# EasyEDA Pro project Bike-Computer-v2.eprj

# Schematic Schematic3
Create Date: 2023-03-25; Page Name: 母板原理图; Project Name: 结题工程v2; Schematic Name: Schematic3; Update Date: 2023-12-21; Add into BOM: yes; Company: 立项小组; Convert to PCB: yes; Drawed: chaos0514; Version: V2.0
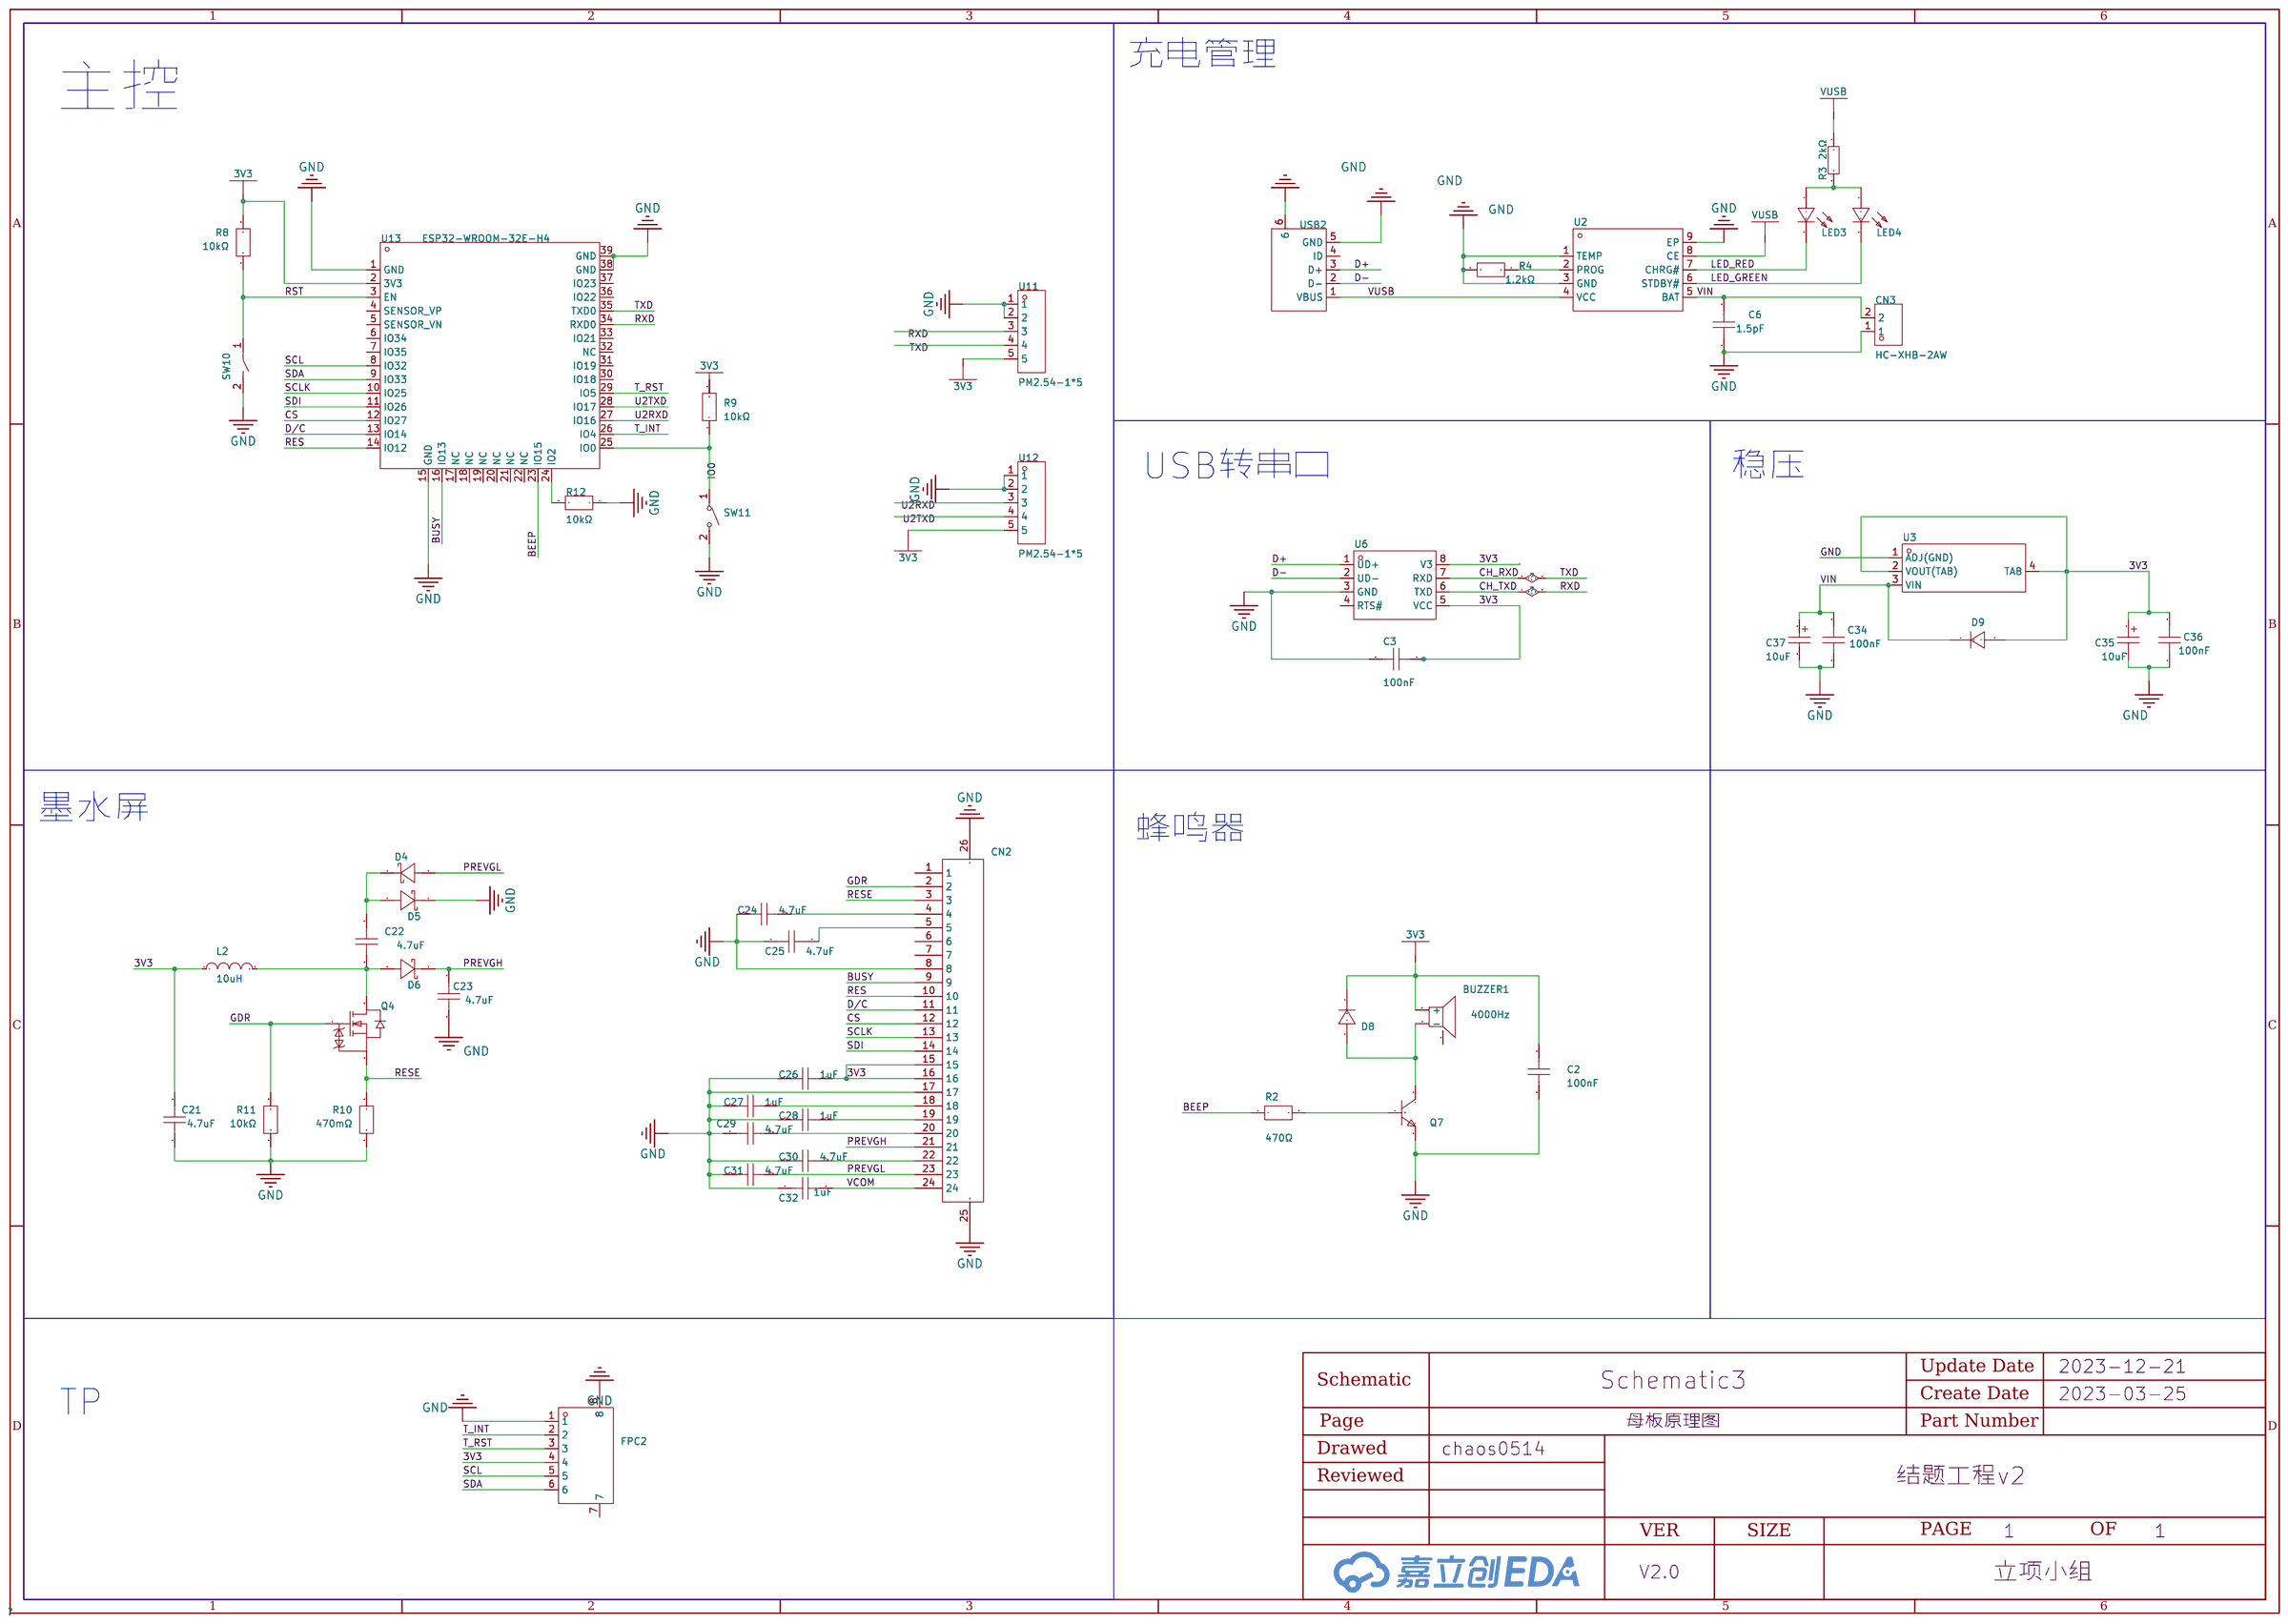
[diagram p0: schematic sheet]

## Parts
BUZZER1  4000Hz  [BUZ-SMD_L5.0-W5.5-P4.60]
C2  100nF  [C0603]
C3  100nF  [C0603]
C6  1.5pF  [C0603]
C21  4.7uF  [C0603]
C22  4.7uF  [C0603]
C23  4.7uF  [C0603]
C24  4.7uF  [C0603]
C25  4.7uF  [C0603]
C26  1uF  [C0603]
C27  1uF  [C0603]
C28  1uF  [C0603]
C29  4.7uF  [C0603]
C30  4.7uF  [C0603]
C31  4.7uF  [C0603]
C32  1uF  [C0603]
C34  100nF  [C0603]
C35  10uF  [CAP-SMD_L3.2-W1.6-RD]
C36  100nF  [C0603]
C37  10uF  [CAP-SMD_L3.2-W1.6-RD]
CN2  0.5-24P翻盖  [FPC-SMD_24P-P0.50-L6.1-W16.4]
CN3  HC-XHB-2AW  [CONN-TH_2P-P2.50_HCTL_HC-XHB-2AW]
D4  MBR0530  [SOD-123_L2.7-W1.6-LS3.7-RD-1]
D5  MBR0530  [SOD-123_L2.7-W1.6-LS3.7-RD-1]
D6  MBR0530  [SOD-123_L2.7-W1.6-LS3.7-RD-1]
D8  IN4148WS  [SOD-323_L1.8-W1.3-LS2.5-RD]
D9  IN4148WS  [SOD-323_L1.8-W1.3-LS2.5-RD]
FPC2  0.5K-DX-6PWB  [FPC-SMD_6P-P0.50_DEALON_0.5K-DX-6PWB]
L2  10uH  [IND-SMD_L2.0-W1.6]
LED3  NCD0603R1  [LED0603-RD_RED]
LED4  NCD0603R1  [LED0603-RD_RED]
Q4  SI1308EDL-T1-GE3  [SOT-323_L2.0-W1.3-P1.30-LS2.1-BR]
Q7  KST8050S  [SOT-23_L2.9-W1.3-P1.90-LS2.4-BR]
R2  470Ω  [R0603]
R3  2kΩ  [R0603]
R4  1.2kΩ  [R0603]
R8  10kΩ  [R0603]
R9  10kΩ  [R0603]
R10  470mΩ  [R0603]
R11  10kΩ  [R0603]
R12  10kΩ  [R0603]
SW10  YTSB013A0502501B  [SW-SMD_L6.0-W3.5-LS8.0]
SW11  TS-1096S-A2B3-C1D2  [SW-SMD_L6.0-W3.3-LS8.0]
U2  -  [ESOP-8_L4.9-W3.9-P1.27-LS6.0-BL-EP]
U3  AMS1117-3.3  [SOT-223-4_L6.5-W3.5-P2.30-LS7.0-BR]
U6  -  [SOP-8_L4.9-W3.9-P1.27-LS6.0-BL]
U11  PM2.54-1*5  [HDR-TH_5P-P2.54-V-F]
U12  PM2.54-1*5  [HDR-TH_5P-P2.54-V-F]
U13  ESP32-WROOM-32E-H4  [WIFI-SMD_ESP32-WROOM-32E]
USB2  U254-051N-4BH24-S2S  [MICRO-USB-SMD_U254-051N-4BH24-S2]

## Library data of the parts
BUZZER1 = MLT-5020: 驱动方式:无源(外部驱动);构造类型:电磁式;频率:4000Hz;长度:5.2mm;宽度:5.2mm;高度:2.5mm;; Supplier Part: C94598; Manufacturer: 华能; Supplier Footprint: SMD,5x5mm; JLCPCB Part Class: Extended Part; Datasheet: https://atta.szlcsc.com/upload/public/pdf/source/20210811/111454390007D221D7259018FB170E62.pdf; Supplier: LCSC; Oscillator Circuit: 无源(外部驱动); Technology Type: 电磁式; Length: 5.2mm; Width: 5.2mm; Height: 2.5mm
C2 C3 C34 C36 = CC0603KRX7R9BB104: 容值:100nF;精度:±10%;额定电压:50V;材质(温度系数):X7R;; LCSC Part Name: 100nF ±10% 50V; Supplier Part: C14663; Manufacturer: YAGEO(国巨); Supplier Footprint: 0603; JLCPCB Part Class: Basic Part; Datasheet: https://atta.szlcsc.com/upload/public/pdf/source/20180910/C282072_33301C7F631E79921B82A8DAC6BCC5B3.pdf; Supplier: LCSC; Tolerance: ±10%; Voltage Rated: 50V; Temperature Coefficient: X7R
C6 = MT18N1R5C500CT: 容值:1.5pF;额定电压:50V;材质(温度系数):NP0;; LCSC Part Name: 1.5pF 50V ±0.25pF; Supplier Part: C908503; Manufacturer: Walsin(华新科); Supplier Footprint: 0603; JLCPCB Part Class: Extended Part; Datasheet: https://atta.szlcsc.com/upload/public/pdf/source/20191217/C470045_C8EA1FED8E7D9FF06975A0CE3DEB0325.pdf; Supplier: LCSC; Voltage Rated: 50V; Temperature Coefficient: NP0; Tolerance: ±0.25pF
C21-C25 C29-C31 = C1608X5R1V475KT000E: 容值:4.7uF;精度:±10%;额定电压:35V;材质(温度系数):X5R;; LCSC Part Name: 4.7uF ±10% 35V; Supplier Part: C329940; Manufacturer: TDK; Supplier Footprint: 0603; JLCPCB Part Class: Extended Part; Datasheet: https://atta.szlcsc.com/upload/public/pdf/source/20190926/C329940_3676AC3B1F2ADAB27683D7ACF547C42E.pdf; Supplier: LCSC; Tolerance: ±10%; Voltage Rated: 35V; Temperature Coefficient: X5R
C26-C28 C32 = CL10A105KB8NNNC: 容值:1uF;精度:±10%;额定电压:50V;材质(温度系数):X5R;; LCSC Part Name: 1uF ±10% 50V; Supplier Part: C15849; Manufacturer: SAMSUNG(三星); Supplier Footprint: 0603; JLCPCB Part Class: Basic Part; Datasheet: https://atta.szlcsc.com/upload/public/pdf/source/20160218/1457707763339.pdf; Supplier: LCSC; Tolerance: ±10%; Voltage Rated: 50V; Temperature Coefficient: X5R
C35 C37 = CA45-A-16V-10uF-K: 容值:10uF;精度:±10%;额定电压:16V;等效串联电阻:10Ω@100kHz;; LCSC Part Name: 10uF ±10% 16V; Supplier Part: C128254; Manufacturer: CEC(振华新云); Supplier Footprint: CASE-A-3216; JLCPCB Part Class: Extended Part; Datasheet: https://atta.szlcsc.com/upload/public/pdf/source/20170914/C128254_1505359752472967905.pdf; Supplier: LCSC; Tolerance: ±10%; Rated Voltage: 16V; Equivalent Series Resistance(ESR): 10Ω@100kHz; Operating Temperature: -55℃~+125℃
CN2 = 0.5-24P翻盖: 间距:0.5mm;触点数量:24P;锁定特性:翻盖式;触点类型:下接;安装类型:卧贴;工作温度范围:-;; LCSC Part Name: 间距:0.5mm P数:24P 翻盖式 下接; Supplier Part: C20688; Manufacturer: BOOMELE(博穆精密); Supplier Footprint: SMD,P=0.5mm,卧贴; JLCPCB Part Class: Extended Part; Datasheet: https://atta.szlcsc.com/upload/public/pdf/source/20210518/C2835077_01BB588238C9E5C5C5B2931B95D00EB1.pdf; Supplier: LCSC; Pitch: 0.5mm; Number of Contacts: 24P; Locking Feature: 翻盖式; FFC, FCB Thickness: 0.3mm; Contact Type: 下接; Mounting Type: 卧贴; Height Above Board: 2mm
CN3 = HC-XHB-2AW_C2845505: 插针结构:1x2P;间距:2.5mm;公母:公;安装方式:弯插;行距:-;排数:1;每排PIN数:2;参考系列:-;额定电流:3A;工作温度范围:-25℃~+85℃;; LCSC Part Name: 1x2P 间距:2.5mm 弯插; Supplier Part: C2845505; Manufacturer: HCTL(华灿天禄); Supplier Footprint: 弯插,P=2.5mm; JLCPCB Part Class: Extended Part; Datasheet: https://atta.szlcsc.com/upload/public/pdf/source/20230711/E76CB2F3936D97053488B02AAFAB274A.pdf; Supplier: LCSC; Pins Structure: 1x2P; Pitch: 2.5mm; Gender: 公; Mounting Style: 弯插; Number of Rows: 1; Number of PINs Per Row: 2; Current Rating (Max): 3A; Operating Temperature Range: -25℃~+85℃
D4-D6 = MBR0530_C699108: 直流反向耐压(Vr):30V;平均整流电流(Io):500mA;正向压降(Vf):550mV@500mA;; LCSC Part Name: 电压:30V 电流:500mA; Supplier Part: C699108; Manufacturer: YANGJIE(扬杰); Supplier Footprint: SOD-123; JLCPCB Part Class: Extended Part; Datasheet: https://atta.szlcsc.com/upload/public/pdf/source/20200709/C699108_94C8F1A54679DD603C9696C8694A3BC2.pdf; Supplier: LCSC; Reverse Voltage (Vr): 30V; Average Rectified Current (Io): 500mA; Forward Voltage (Vf@If): 550mV@500mA; Reverse Leakage Current (Ir): 100uA@30V
D8 D9 = IN4148WS: 二极管配置:独立式;功率:200mW;直流反向耐压(Vr):100V;平均整流电流(Io):200mA;正向压降(Vf):1V@10mA;反向电流(Ir):5A@75V;反向恢复时间(trr):4ns;工作温度:+150@(Tj);; LCSC Part Name: 100V 200mA 4ns; Supplier Part: C417545; Manufacturer: LRC(乐山无线电); Supplier Footprint: SOD-323; JLCPCB Part Class: 扩展库; Datasheet: https://atta.szlcsc.com/upload/public/pdf/source/20190911/C417545_CB999573A39316D3E44B0FF1B4B78E30.pdf; Supplier: LCSC; Diode Configuration: 独立式; Power Dissipation: 200mW; Reverse Voltage (Vr): 100V; Average Rectified Current (Io): 200mA; Forward Voltage (Vf@If): 1V@10mA; Reverse Leakage Current: 5A@75V; Reverse Recovery Time (trr): 4ns; Operating Temperature: +150@(Tj)
FPC2 = 0.5K-DX-6PWB: 间距:0.5mm;触点数量:6P;锁定特性:翻盖式;触点类型:下接;安装类型:卧贴;工作温度范围:-20℃~+85℃;; LCSC Part Name: 间距:0.5mm P数:6P 翻盖式 下接; Supplier Part: C2911832; Manufacturer: HDGC(华德共创); Supplier Footprint: SMD,P=0.5mm,卧贴; JLCPCB Part Class: Extended Part; Datasheet: https://atta.szlcsc.com/upload/public/pdf/source/20211029/5210AEC837E1AC9B697C39805C1E664F.pdf; Supplier: LCSC; Pitch: 0.5mm; Number of Contacts: 6P; Locking Feature: 翻盖式; FFC, FCB Thickness: 0.3mm; Contact Type: 下接; Mounting Type: 卧贴; Height Above Board: 2mm; Operating Temperature Range: -20℃~+85℃
L2 = WPN201610H100MT: 电感值:10uH;精度:±20%;额定电流:650mA;类型:-;饱和电流(Isat):800mA;; LCSC Part Name: 10uH ±20% 800mA; Supplier Part: C89132; Manufacturer: Sunlord(顺络); Supplier Footprint: 0806; JLCPCB Part Class: Extended Part; Datasheet: https://atta.szlcsc.com/upload/public/pdf/source/20231024/AA72387348CB63159A6CBE41DDE5ECDA.pdf; Supplier: LCSC; Tolerance: ±20%; Rated Current: 650mA; DC Resistance (DCR): 826mΩ; Saturation Current (Isat): 800mA
LED3 LED4 = NCD0603R1_C84263: 发光颜色:红色;功率:65mW;透镜颜色:无色透明;主波长:615nm~630nm;发光强度:80mcd~220mcd;发光角度:130°;工作温度:-30℃~+85℃;; LCSC Part Name: 红灯 0603红灯   正贴; Supplier Part: C84263; Manufacturer: 国星光电; Supplier Footprint: 0603; JLCPCB Part Class: Extended Part; Datasheet: https://atta.szlcsc.com/upload/public/pdf/source/20200820/C84263_DABC6A75E58F576973B407FDBA283D60.pdf; Supplier: LCSC; Emitted Color: 红色; Forward Voltage (VF): 1.6V~2.6V; Forward Current: 20mA; Power Dissipation: 65mW; Lens Color: 无色透明; Dominant Wavelength: 615nm~630nm; Luminous Intensity: 80mcd~220mcd; Viewing Angle: 130°; Operating Temperature: -30℃~+85℃
Q4 = SI1308EDL-T1-GE3: 类型:N沟道;漏源电压(Vdss):30V;连续漏极电流(Id):1.4A;功率(Pd):400mW；500mW;导通电阻(RDS(on)@Vgs,Id):132mΩ@10V,1.4A;; LCSC Part Name: N沟道 30V 1.4A; Supplier Part: C469327; Manufacturer: VISHAY(威世); Supplier Footprint: SOT-323; JLCPCB Part Class: Extended Part; Datasheet: https://atta.szlcsc.com/upload/public/pdf/source/20191217/C469327_3FE8BCBB7604A1B1F6779A1D9DD725BB.pdf; Supplier: LCSC; Type: N沟道; Drain Source Voltage (Vdss): 30V; Continuous Drain Current (Id): 1.4A; Power Dissipation (Pd): 400mW；500mW; Drain Source On Resistance (RDS(on)@Vgs,Id): 132mΩ@10V,1.4A; Gate Threshold Voltage (Vgs(th)@Id): 1.5V@250uA; Total Gate Charge (Qg@Vgs): 4.1nC@10V; Input Capacitance (Ciss@Vds): 105pF@15V; Operating Temperature: -55℃~+150℃@(Tj)
Q7 = KST8050S: 晶体管类型:NPN;集射极击穿电压(Vceo):25V;集电极电流(Ic):500mA;功率(Pd):300mW;; Supplier Part: C369924; Manufacturer: KEXIN(科信); Supplier Footprint: SOT-23; JLCPCB Part Class: 扩展库; Datasheet: https://atta.szlcsc.com/upload/public/pdf/source/20190320/C369924_F8D3618043520638745BFFFB8460FA42.pdf; Supplier: LCSC; Transistor Type: NPN; Collector-Emitter Breakdown Voltage (Vceo): 25V; Collector Current (Ic): 500mA; Power Dissipation (Pd): 300mW
R2 = 0603WAF4700T5E: 阻值:470Ω;精度:±1%;功率:100mW;温度系数:±100ppm/℃;电阻类型:厚膜电阻;; LCSC Part Name: 470Ω ±1% 100mW 厚膜电阻; Supplier Part: C23179; Manufacturer: UNI-ROYAL(厚声); Supplier Footprint: 0603; JLCPCB Part Class: Basic Part; Datasheet: https://atta.szlcsc.com/upload/public/pdf/source/20200306/C422600_1E6D84923E4A46A82E41ADD87F860B5C.pdf; Supplier: LCSC; Tolerance: ±1%; Power(Watts): 100mW; Overload Voltage (Max): 75V; Temperature Coefficient: ±100ppm/℃; Type: 厚膜电阻; Operating Temperature Range: -55℃~+155℃
R3 = 0603WAF2001T5E: 阻值:2kΩ;精度:±1%;功率:100mW;温度系数:±100ppm/℃;电阻类型:厚膜电阻;; LCSC Part Name: 2kΩ ±1% 100mW 厚膜电阻; Supplier Part: C22975; Manufacturer: UNI-ROYAL(厚声); Supplier Footprint: 0603; JLCPCB Part Class: Basic Part; Datasheet: https://atta.szlcsc.com/upload/public/pdf/source/20200306/C422600_1E6D84923E4A46A82E41ADD87F860B5C.pdf; Supplier: LCSC; Tolerance: ±1%; Power(Watts): 100mW; Overload Voltage (Max): 75V; Temperature Coefficient: ±100ppm/℃; Type: 厚膜电阻; Operating Temperature Range: -55℃~+155℃
R4 = 0603WAF1201T5E: 阻值:1.2kΩ;精度:±1%;功率:100mW;温度系数:±100ppm/℃;电阻类型:厚膜电阻;; LCSC Part Name: 1.2kΩ ±1% 100mW 厚膜电阻; Supplier Part: C22765; Manufacturer: UNI-ROYAL(厚声); Supplier Footprint: 0603; JLCPCB Part Class: Basic Part; Datasheet: https://atta.szlcsc.com/upload/public/pdf/source/20200306/C422600_1E6D84923E4A46A82E41ADD87F860B5C.pdf; Supplier: LCSC; Tolerance: ±1%; Power(Watts): 100mW; Overload Voltage (Max): 75V; Temperature Coefficient: ±100ppm/℃; Type: 厚膜电阻; Operating Temperature Range: -55℃~+155℃
R8 R9 R11 R12 = SG73P1JTTD1002F: 阻值:10kΩ;精度:±1%;功率:-;; LCSC Part Name: 10kΩ ±1%; Supplier Part: C880254; Manufacturer: KOA; Supplier Footprint: 0603; JLCPCB Part Class: Extended Part; Datasheet: https://atta.szlcsc.com/upload/public/pdf/source/20190109/C346159_A2BB9C83E7E727C8F8277542505B206B.pdf; Supplier: LCSC; Tolerance: ±1%
R10 = 0603WAF470LT5E: 阻值:470mΩ;精度:±1%;功率:100mW;温度系数:±800ppm/℃;电阻类型:厚膜电阻;; LCSC Part Name: 470mΩ ±1% 100mW 厚膜电阻; Supplier Part: C23411; Manufacturer: UNI-ROYAL(厚声); Supplier Footprint: 0603; JLCPCB Part Class: Extended Part; Datasheet: https://atta.szlcsc.com/upload/public/pdf/source/20200306/C422600_1E6D84923E4A46A82E41ADD87F860B5C.pdf; Supplier: LCSC; Tolerance: ±1%; Power(Watts): 100mW; Overload Voltage (Max): 75V; Temperature Coefficient: ±800ppm/℃; Type: 厚膜电阻; Operating Temperature Range: -55℃~+155℃
SW10 = YTSB013A0502501B: 电路结构:单刀单掷;带支架:否;触点电流:50mA;额定电压(DC):12V;安装方式:立贴;绝缘电阻:100MΩ;作用力:250gf;机械寿命:2万次;; LCSC Part Name: 6*3.5*5mm 立贴 轻触开关 编带; Supplier Part: C967845; Manufacturer: DGBZ(东莞博众); Supplier Footprint: SMD; JLCPCB Part Class: Extended Part; Datasheet: https://atta.szlcsc.com/upload/public/pdf/source/20201210/C967845_000D5BB842D0C8EF327DE27DA8975160.pdf; Supplier: LCSC; Circuit: 单刀单掷; Actuator Style: 方形按钮; Switch Length: 6mm; Switch Width: 3.5mm; Switch Height: 5mm; Strike Gundam: 否; Contact Current: 50mA; Voltage Rating (DC): 12V; Mounting Style: 立贴; Insulation Resistance: 100MΩ; Actuator/Cap Color: 白色; Operating Force: 250gf; Pin Style: 鸥翼型; Mechanical Life: 2万次
SW11 = TS-1096S-A2B3-C1D2: 电路结构:单刀单掷;按钮作用方向:顶部触动;致动器样式:矩形按钮;照明颜色:-;开关长度:6mm;开关宽度:3.3mm;开关高度:5mm;; LCSC Part Name: 轻触开关3*6*5.0mm贴片SMD两脚全白色250gf; Supplier Part: C492871; Manufacturer: Yuandi(元迪); JLCPCB Part Class: Extended Part; Datasheet: https://atta.szlcsc.com/upload/public/pdf/source/20200316/C492866_AE9F76941B75629D08A60E2DD345E347.pdf; Supplier: LCSC; Circuit: 单刀单掷; Actuator Orientation: 顶部触动; Actuator Style: 矩形按钮; Switch Length: 6mm; Switch Width: 3.3mm; Switch Height: 5mm
U2 = TP4056: 充电电池的类型:-;电池单元组数:-;最大充电电流:-;充满的电池组电压:-;最大供应电压:-;; Supplier Part: C725790; Manufacturer: UMW(友台半导体); Supplier Footprint: ESOP-8; JLCPCB Part Class: Extended Part; Datasheet: https://atta.szlcsc.com/upload/public/pdf/source/20211011/37515E71BA298E23D23475482C49633D.pdf; Supplier: LCSC
U3 = AMS1117-3.3_C347222: 输出类型:固定;最大输入电压:18V;输出电压:3.3V;输出电流:1A;电源纹波抑制比(PSRR):60dB@(120Hz);输出极性:正;; LCSC Part Name: 输入18V 输出3.3V 1A; Supplier Part: C347222; Manufacturer: UMW(友台半导体); Supplier Footprint: SOT-223; JLCPCB Part Class: Extended Part; Datasheet: https://atta.szlcsc.com/upload/public/pdf/source/20231109/155D79A26D9DB04352555A58D5969DC8.pdf; Supplier: LCSC; Output Type: 固定; Maximum Input Voltage: 18V; Output Voltage: 3.3V; Output Current: 1A; Power Supply Rejection Ratio (PSRR): 60dB@(120Hz); Dropout Voltage: 1.3V@(1A); Output Polarity: 正; Number of Outputs: 1; Power Supply Rejection Ratio (PRSS): 60dB@(120Hz)
U6 = CH340N: Supplier Part: C2977777; Manufacturer: WCH(南京沁恒); Supplier Footprint: SOP-8; JLCPCB Part Class: Extended Part; Datasheet: https://atta.szlcsc.com/upload/public/pdf/source/20220223/82A45E4FF89B3EDCAD50B354450A7EF4.pdf; Supplier: LCSC
U11 U12 = PM2.54-1*5: 插孔结构:1x5P;间距:2.54mm;总孔位数:5P;安装类型:直插;排数:单排;行距:2.54mm;圆孔/方孔:方孔;额定电流:2.5A;插孔方向:顶部;塑高:8.5mm;工作温度范围:-40℃~+105℃;; LCSC Part Name: 间距:2.54mm 1x5P 直插 镀金环保阻燃UL认证; Supplier Part: C5116488; Manufacturer: ZHOURI(洲日); Supplier Footprint: 插件,P=2.54mm; JLCPCB Part Class: Extended Part; Datasheet: https://atta.szlcsc.com/upload/public/pdf/source/20220803/9CD49C6F5EDF44A82395C8C3734B0185.pdf; Supplier: LCSC; Holes Structure: 1x5P; Pitch: 2.54mm; Number of Holes: 5P; Mounting Type: 直插; Number of Rows: 单排; Row Spacing: 2.54mm; Circular Hole / Square Hole: 方孔; Current Rating (Max): 2.5A; Holes Direction: 顶部; Insulation Height: 8.5mm; Operating Temperature Range: -40℃~+105℃
U13 = ESP32-WROOM-32E-H4: 命名更改，4MB即H4，为尾缀，模组丝印更改为H4，H为高温105°C，软硬件无更改; Supplier Part: C3013935; Manufacturer: ESPRESSIF(乐鑫); Supplier Footprint: SMD,18x25.5mm; JLCPCB Part Class: Extended Part; Datasheet: https://atta.szlcsc.com/upload/public/pdf/source/20220506/2B7DF1E5B41DABC7447F735C715CAF22.pdf; Supplier: LCSC
USB2 = U254-051N-4BH24-S2S: 连接器类型:Micro-B;标准:USB 2.0;公母:母;触点数量:5P;端口数量:1;安装方式:卧贴;额定电流 - 电源:1.8A;触头材质:铜合金;触头镀层:金;工作温度范围:-40℃~+85℃;焊接温度(最大值):260℃;; LCSC Part Name: Micro-B 母 卧贴 牛角5.2; Supplier Part: C692421; Manufacturer: XKB Connectivity(中国星坤); Supplier Footprint: SMD; JLCPCB Part Class: Extended Part; Datasheet: https://atta.szlcsc.com/upload/public/pdf/source/20211011/B206D16459F712703796869A87C6FBF1.pdf; Supplier: LCSC; Connector Type: Micro-B; Standard: USB 2.0; Gender: 母; Number of Contacts: 5P; Number of Ports: 1; Mounting Style: 卧贴; Current Rating - Power (Max): 1.8A; Contact Material: 铜合金; Contact Plating: 金; Operating Temperature Range: -40℃~+85℃; Welding Temperature (Max): 260℃

## Nets
3V3: BUZZER1.2(+) C2.1 C3.1 C21.2 C26.1 C35.1 C36.2 CN2.15 CN2.16 D8.1(C) D9.2(A) FPC2.4 L2.1 R8.2 R9.2 U3.2(VOUT(TAB)) U3.4(TAB) U6.5(VCC) U6.8(V3) U11.5 U12.5 U13.2(3V3)
GND: C2.2 C3.2 C6.1 C21.1 C23.1 C24.2 C25.2 C26.2 C27.2 C28.2 C29.2 C30.2 C31.2 C32.2 C34.1 C35.2 C36.1 C37.2 CN2.8 CN2.17 CN2.25 CN2.26 CN3.1 D5.1(K) FPC2.1 FPC2.8 Q7.2(E) R4.2 R10.1 R11.1 R12.1 SW10.2 SW11.2 U2.1(TEMP) U2.3(GND) U2.9(EP) U3.1(ADJ(GND)) U6.3(GND) U11.1 U11.2 U12.1 U12.2 U13.1(GND) U13.15(GND) U13.38(GND) U13.39(GND) USB2.5(GND) USB2.6
VIN: C6.2 C34.2 C37.1 CN3.2 D9.1(C) U2.5(BAT) U3.3(VIN)
BEEP: R2.1 U13.23(IO15)
BUSY: CN2.9 U13.16(IO13)
CH_RXD: U6.7(RXD) U11.4 U13.35(TXD0)
CH_TXD: U6.6(TXD) U11.3 U13.34(RXD0)
CS: CN2.12 U13.12(IO27)
D+: U6.1(UD+) USB2.3(D+)
D-: U6.2(UD-) USB2.2(D-)
D/C: CN2.11 U13.13(IO14)
GDR: CN2.2 Q4.1(G) R11.2
IO0: R9.1 SW11.1 U13.25(IO0)
LED_GREEN: LED4.2(K) U2.6(STDBY#)
LED_RED: LED3.2(K) U2.7(CHRG#)
PREVGH: C23.2 CN2.21 D6.1(K)
PREVGL: C31.1 CN2.23 D4.2(A)
RES: CN2.10 U13.14(IO12)
RESE: CN2.3 Q4.2(S) R10.2
RST: R8.1 SW10.1 U13.3(EN)
SCL: FPC2.5 U13.8(IO32)
SCLK: CN2.13 U13.10(IO25)
SDA: FPC2.6 U13.9(IO33)
SDI: CN2.14 U13.11(IO26)
T_INT: FPC2.2 U13.26(IO4)
T_RST: FPC2.3 U13.29(IO5)
U2RXD: U12.3 U13.27(IO16)
U2TXD: U12.4 U13.28(IO17)
VCOM: C32.1 CN2.24
VUSB: R3.1 U2.4(VCC) U2.8(CE) USB2.1(VBUS)
$2N3027: C22.1 D6.2(A) L2.2 Q4.3(D)
$2N3288: C22.2 D4.1(K) D5.2(A)
$2N4058: C24.1 CN2.4
$2N4145: C25.1 CN2.5
$2N5416: C27.1 CN2.18
$2N5433: C28.1 CN2.19
$2N5698: C29.1 CN2.20
$2N6495: C30.1 CN2.22
$2N38885: R4.1 U2.2(PROG)
$2N78308: Q7.1(B) R2.2
$2N78453: BUZZER1.3(-) D8.2(A) Q7.3(C)
$2N122372: R12.2 U13.24(IO2)
$2N122866: LED3.1(A) LED4.1(A) R3.2

Not connected (* = marked no-connect by the designer): BUZZER1 1(NC); CN2 1 6 7; FPC2 7; U6 4(RTS#); U13 4(SENSOR_VP) 5(SENSOR_VN) 6(IO34) 7(IO35) 17(NC) 18(NC) 19(NC) 20(NC) 21(NC) 22(NC) 30(IO18) 31(IO19) 32(NC) 33(IO21) 36(IO22) 37(IO23); USB2 4(ID)

## Notes on the sheet
- 充电管理
- 主控
- USB转串口
- 稳压
- 墨水屏
- 蜂鸣器
- TP

# Schematic Schematic4
Create Date: 2023-12-05; Page Name: 拓展板原理图; Project Name: 结题工程v2; Schematic Name: Schematic4; Update Date: 2023-12-21; Company: 立项小组; Drawed: chaos0514; Page Size: A4; Version: V2.0
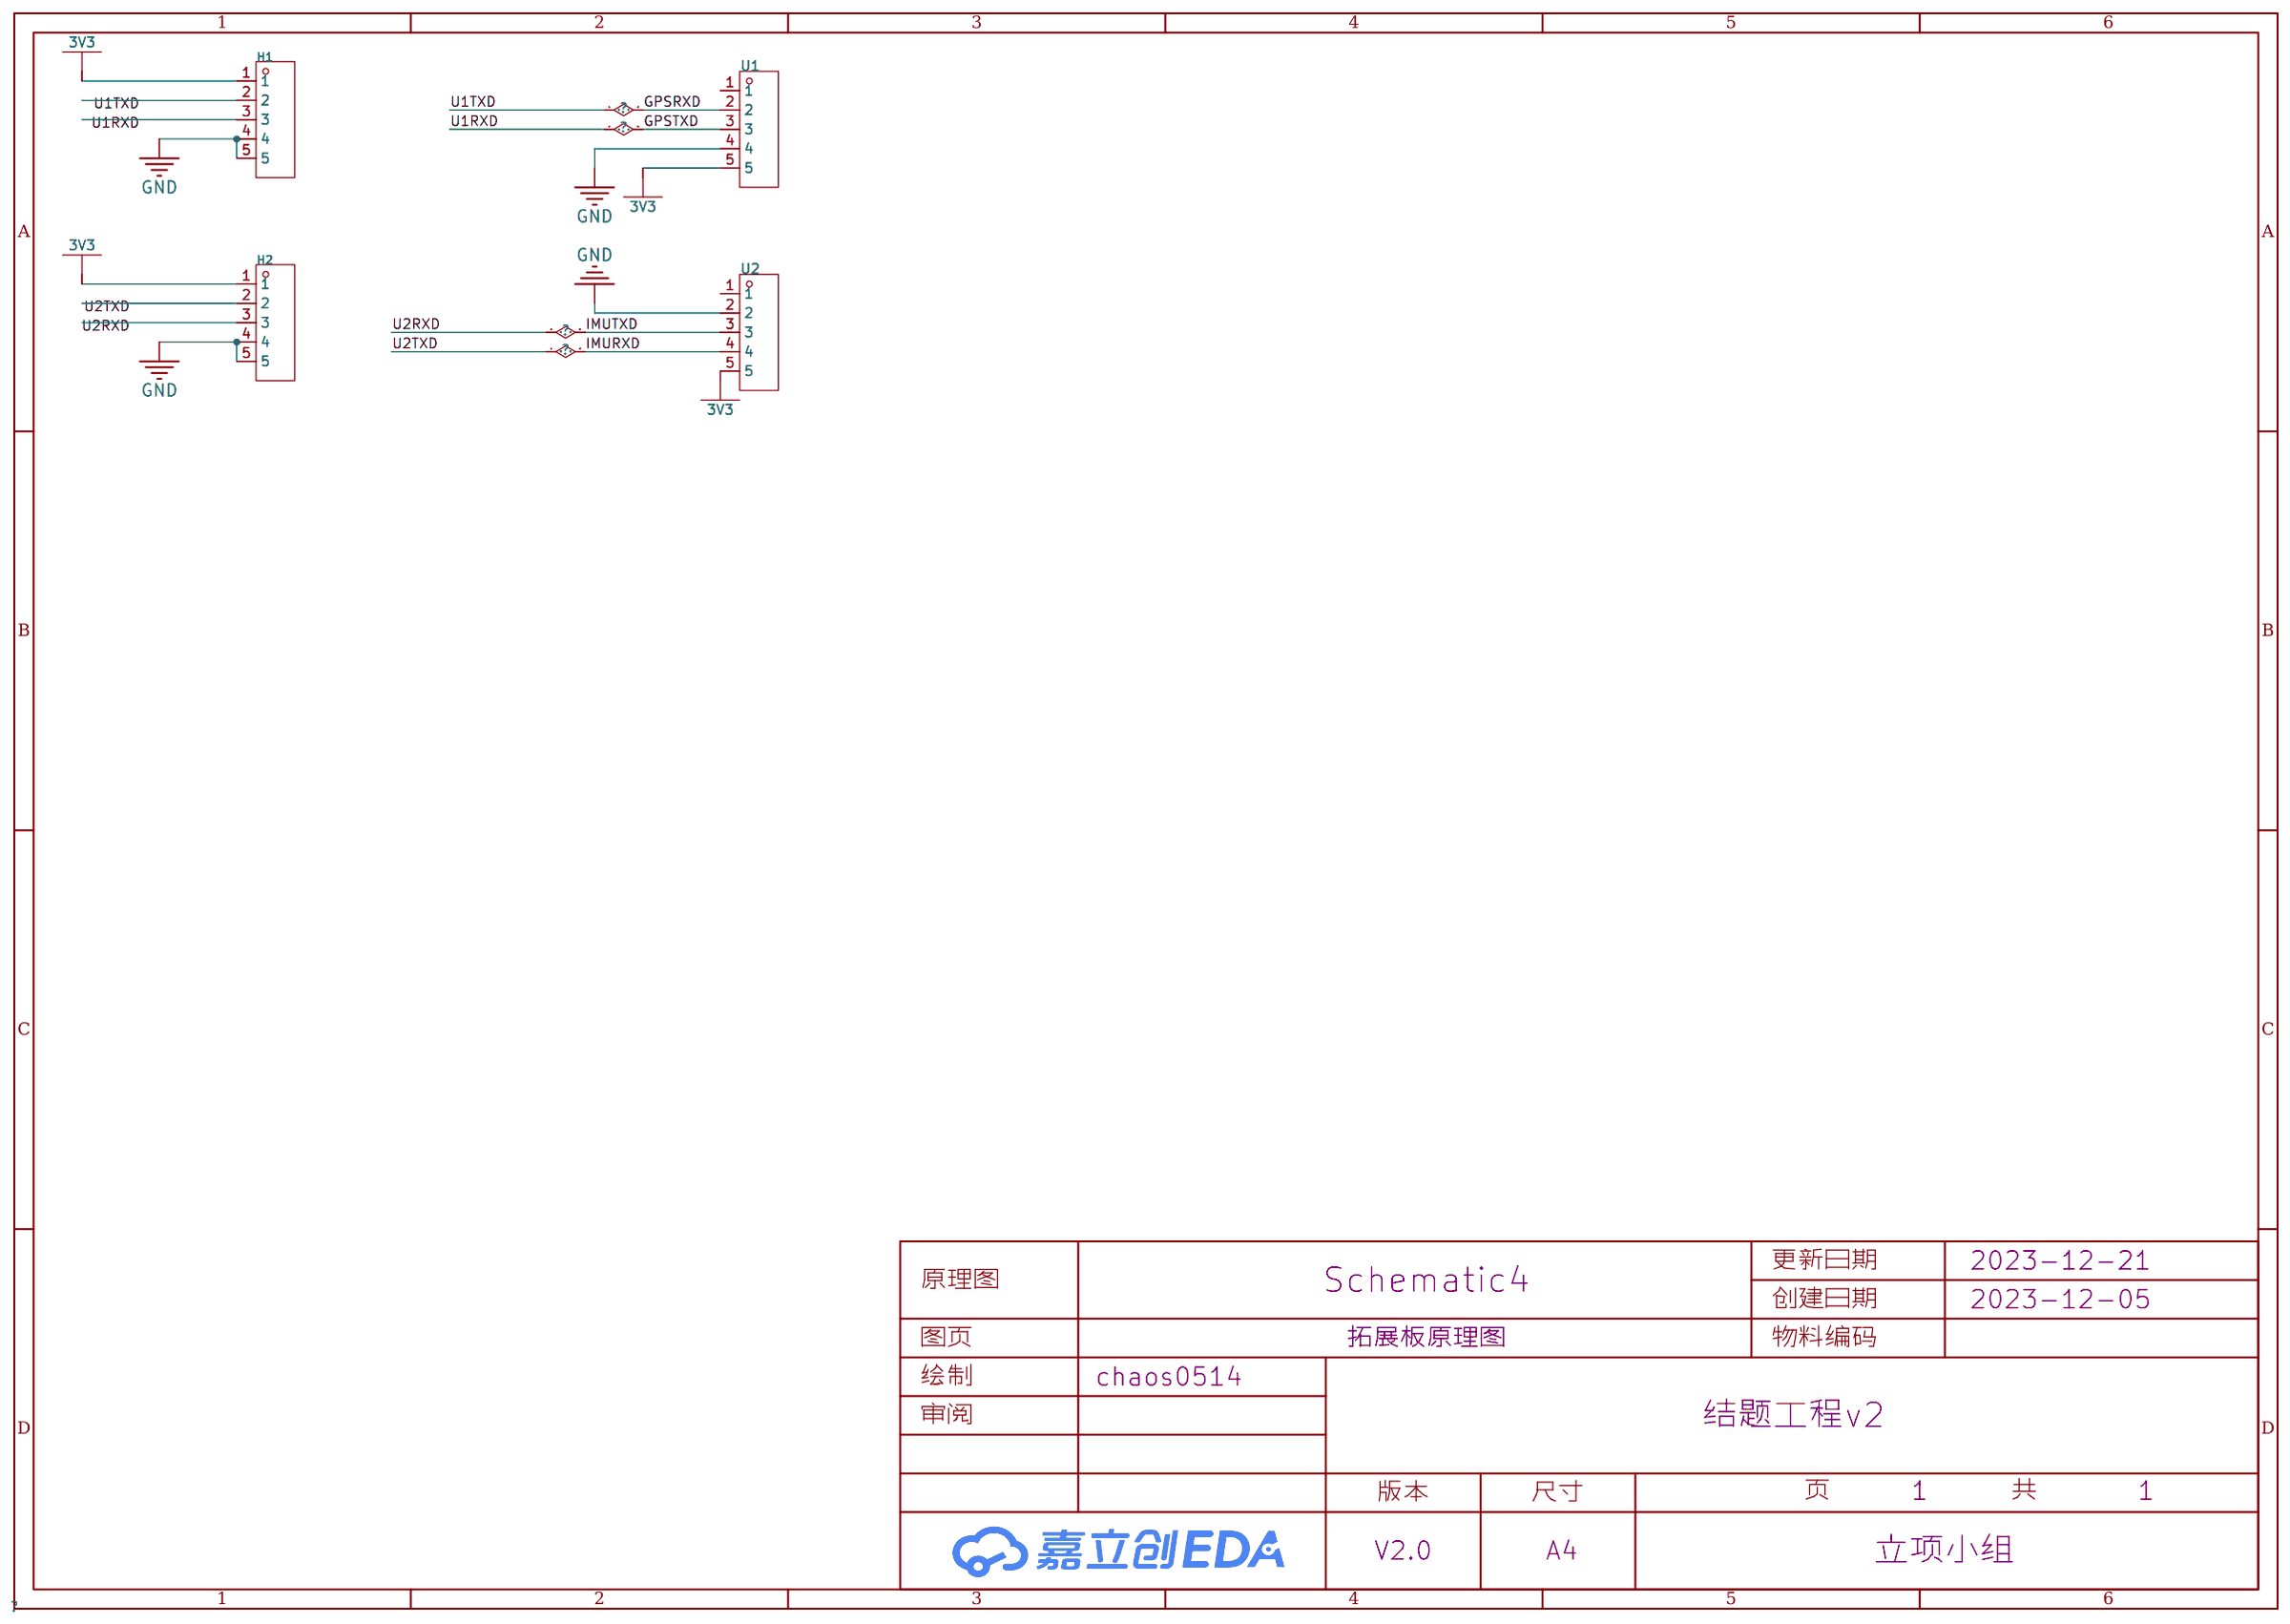
[diagram p1: schematic sheet]

## Parts
H1  210-81-05GB01  [HDR-TH_5P-P2.54-V-M]
H2  210-81-05GB01  [HDR-TH_5P-P2.54-V-M]
U1  PM2.54-1*5  [HDR-TH_5P-P2.54-V-F]
U2  PM2.54-1*5  [HDR-TH_5P-P2.54-V-F]

## Library data of the parts
H1 H2 = 210-81-05GB01: 排数:单排;总PIN位数:5;间距:2.54mm;插针结构:1x5P;行距:-;安装类型:直插;圆针/方针:方针;额定电流:3A;额定电压:-;配合针长度:6.1mm;塑高:2.5mm;端接针长度:3mm;触头材质:黄铜;触头镀层:-;工作温度范围:-40℃~+105℃;颜色:黑色;; LCSC Part Name: 2.54mm 1x5P 直插 方针; Supplier Part: C390676; Manufacturer: PINREX(频锐科技); Supplier Footprint: 插件,P=2.54mm; JLCPCB Part Class: Extended Part; Supplier: LCSC; Number of Rows: 单排; Number of Pins: 5; Pitch: 2.54mm; Pin Structure: 1x5P; Mounting Type: 直插; Circluar Pins/Square Pins: 方针; Current Rating (Max): 3A; Length of Mating Pin: 6.1mm; Insulation Height: 2.5mm; Length of End Connection Pin: 3mm; Contact Material: 黄铜; Operating Temperature Range: -40℃~+105℃; Color: 黑色
U1 U2 = PM2.54-1*5: 插孔结构:1x5P;间距:2.54mm;总孔位数:5P;安装类型:直插;排数:单排;行距:2.54mm;圆孔/方孔:方孔;额定电流:2.5A;插孔方向:顶部;塑高:8.5mm;工作温度范围:-40℃~+105℃;; LCSC Part Name: 间距:2.54mm 1x5P 直插 镀金环保阻燃UL认证; Supplier Part: C5116488; Manufacturer: ZHOURI(洲日); Supplier Footprint: 插件,P=2.54mm; JLCPCB Part Class: Extended Part; Datasheet: https://atta.szlcsc.com/upload/public/pdf/source/20220803/9CD49C6F5EDF44A82395C8C3734B0185.pdf; Supplier: LCSC; Holes Structure: 1x5P; Pitch: 2.54mm; Number of Holes: 5P; Mounting Type: 直插; Number of Rows: 单排; Row Spacing: 2.54mm; Circular Hole / Square Hole: 方孔; Current Rating (Max): 2.5A; Holes Direction: 顶部; Insulation Height: 8.5mm; Operating Temperature Range: -40℃~+105℃

## Nets
3V3: H1.1 H2.1 U1.5 U2.5
GND: H1.4 H1.5 H2.4 H2.5 U1.4 U2.2
GPSRXD: H1.2 U1.2
GPSTXD: H1.3 U1.3
IMURXD: H2.2 U2.4
IMUTXD: H2.3 U2.3

Not connected (* = marked no-connect by the designer): U1 1; U2 1

# Board 母版PCB
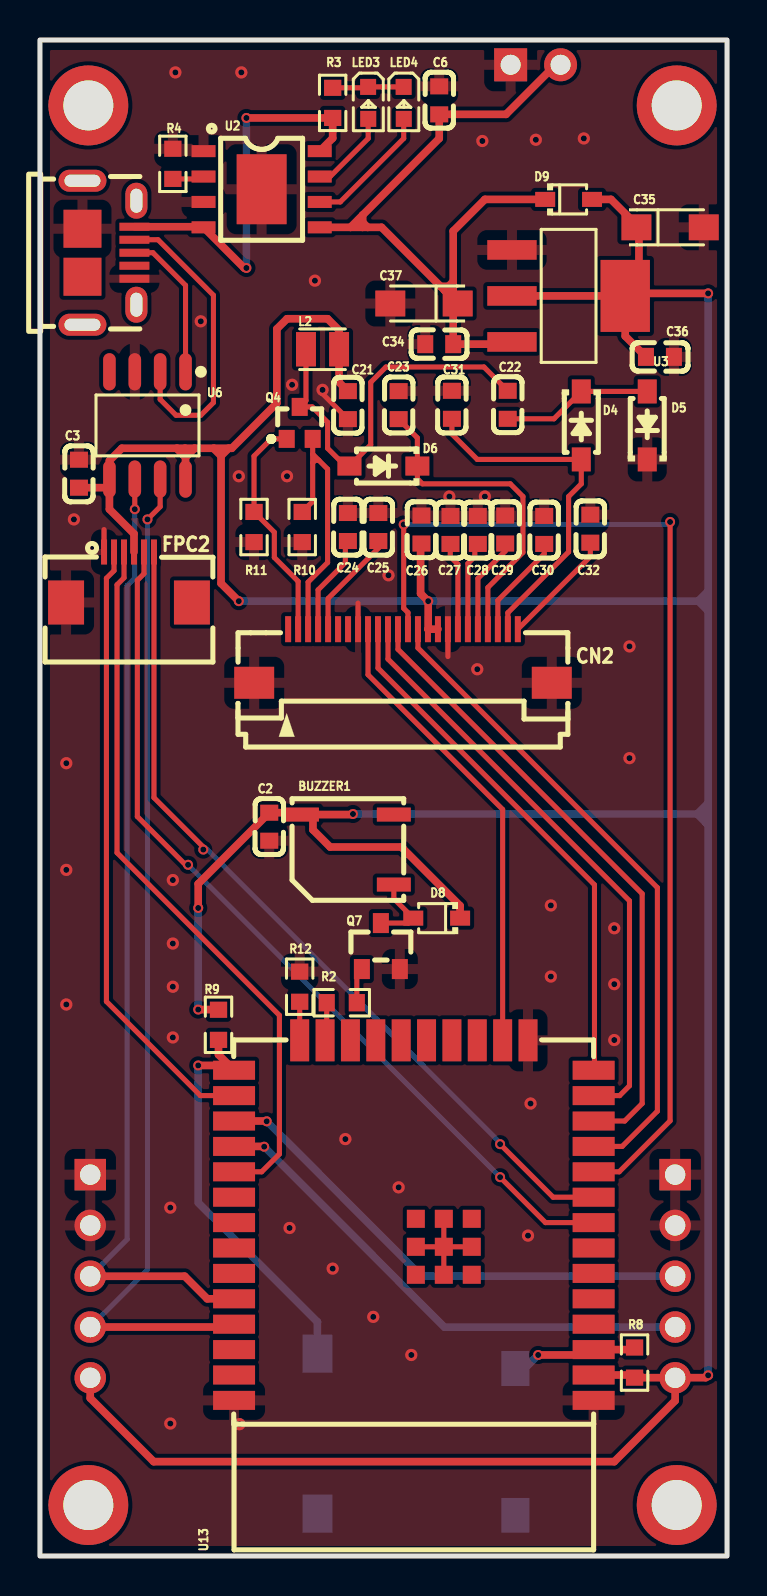
[diagram p2: board, top side]
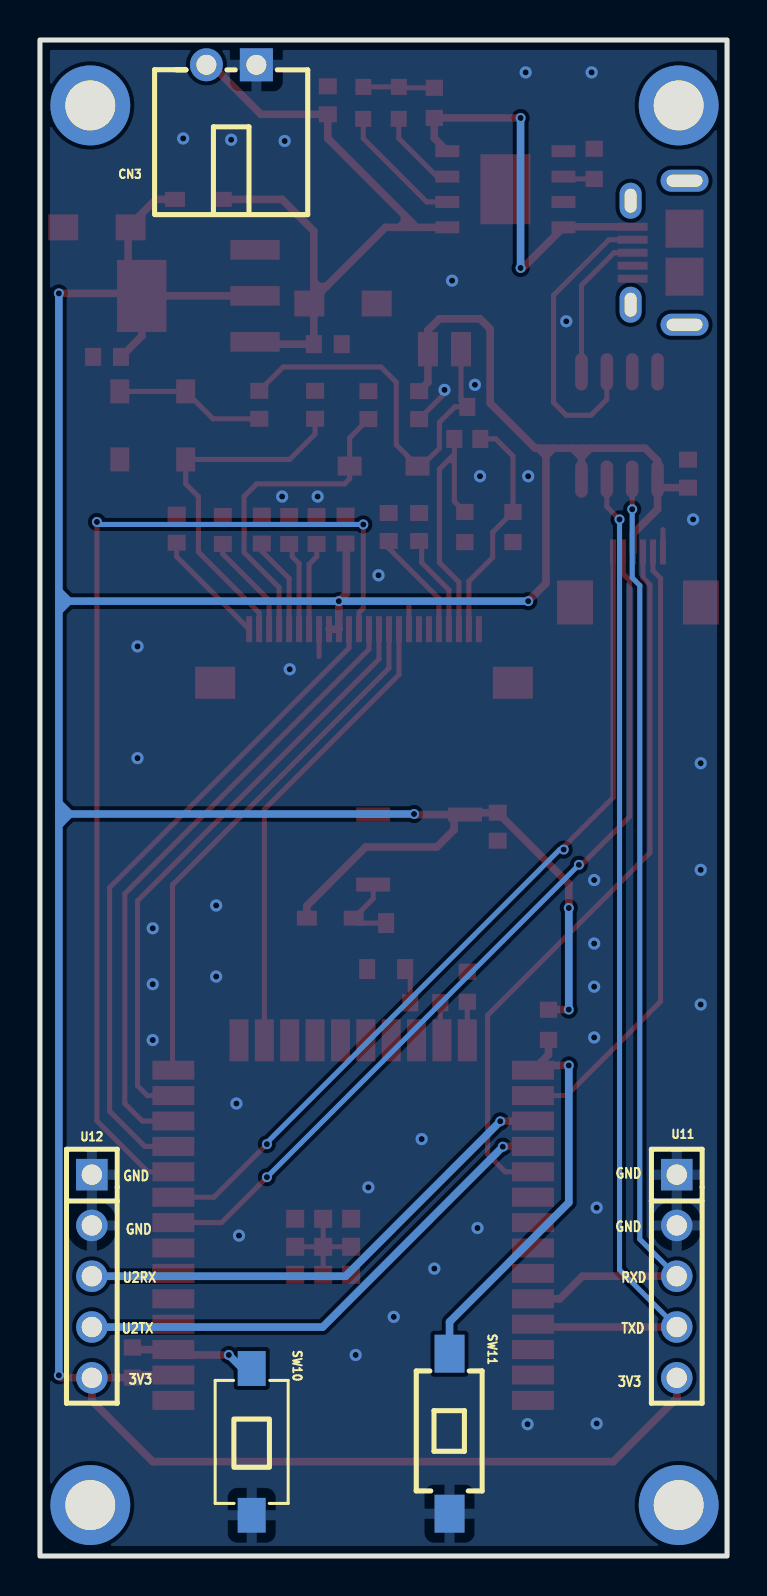
[diagram p3: board, bottom side, seen from below]

Outline 34.4 x 75.81 mm; copper layers: Top Layer, Bottom Layer. Coordinates in mm from the lower left corner of the outline.
Outline path: rectangle 0,75.81 34.4,0
Stack: Top Layer 0.035mm / Dielectric1 1.51mm FR4 er 4.5 / Bottom Layer 0.035mm

## Design rules (mm)
spacing safeClearance (default): track to track 0.152, other pairs 0.152 to 0.3
track width trackWidth (default): min 0.127, default 0.254, max 2.54
differential pair differentialPair (default): width min 0.127, default 0.254, max 2.54; gap min 0.152, default 0.152
via viaSize (default): diameter min 0.5, default 0.61, max 10; hole min 0.3, default 0.305, max 6

## Placement (name value [footprint] x y rotation side)
BUZZER1  4000Hz  [BUZ-SMD_L5.0-W5.5-P4.60]  15.42 35.33 180 top
C2  100nF  [C0603]  11.48 36.47 270 top
C3  100nF  [C0603]  1.95 54.12 90 top
C6  1.5pF  [C0603]  19.99 72.79 270 top
C21  4.7uF  [C0603]  15.42 57.55 90 top
C22  4.7uF  [C0603]  23.42 57.57 270 top
C23  4.7uF  [C0603]  17.96 57.55 270 top
C24  4.7uF  [C0603]  15.42 51.45 90 top
C25  4.7uF  [C0603]  16.94 51.45 90 top
C26  1uF  [C0603]  19.1 51.33 90 top
C27  1uF  [C0603]  20.55 51.31 90 top
C28  1uF  [C0603]  21.92 51.31 90 top
C29  4.7uF  [C0603]  23.29 51.33 90 top
C30  4.7uF  [C0603]  25.24 51.31 90 top
C31  4.7uF  [C0603]  20.62 57.57 90 top
C32  1uF  [C0603]  27.55 51.37 90 top
C34  100nF  [C0603]  19.99 60.6 0 top
C35  10uF  [CAP-SMD_L3.2-W1.6-RD]  31.54 66.44 0 top
C36  100nF  [C0603]  31.04 59.96 180 top
C37  10uF  [CAP-SMD_L3.2-W1.6-RD]  19.23 62.63 180 top
CN2  0.5-24P翻盖  [FPC-SMD_24P-P0.50-L6.1-W16.4]  18.17 45.01 0 top
CN3  HC-XHB-2AW  [CONN-TH_2P-P2.50_HCTL_HC-XHB-2AW]  24.81 74.57 180 bottom
D4  MBR0530  [SOD-123_L2.7-W1.6-LS3.7-RD-1]  27.1 56.53 270 top
D5  MBR0530  [SOD-123_L2.7-W1.6-LS3.7-RD-1]  30.4 56.53 90 top
D6  MBR0530  [SOD-123_L2.7-W1.6-LS3.7-RD-1]  17.19 54.5 180 top
D8  IN4148WS  [SOD-323_L1.8-W1.3-LS2.5-RD]  19.86 31.9 180 top
D9  IN4148WS  [SOD-323_L1.8-W1.3-LS2.5-RD]  26.47 67.84 0 top
FPC2  0.5K-DX-6PWB  [FPC-SMD_6P-P0.50_DEALON_0.5K-DX-6PWB]  4.46 48.94 0 top
L2  10uH  [IND-SMD_L2.0-W1.6]  14.15 60.34 0 top
LED3  NCD0603R1  [LED0603-RD_RED]  16.43 72.66 270 top
LED4  NCD0603R1  [LED0603-RD_RED]  18.21 72.66 270 top
NOREF  -  [Pad_e540]  31.88 72.54 0 top
NOREF#2  -  [Pad_e602]  31.88 2.55 0 top
NOREF#3  -  [Pad_e538]  2.42 72.54 0 top
NOREF#4  -  [Pad_e603]  2.42 2.55 0 top
Q4  SI1308EDL-T1-GE3  [SOT-323_L2.0-W1.3-P1.30-LS2.1-BR]  13 56.66 270 top
Q7  KST8050S  [SOT-23_L2.9-W1.3-P1.90-LS2.4-BR]  17.07 30.5 270 top
R2  470Ω  [R0603]  15.11 27.67 0 top
R3  2kΩ  [R0603]  14.65 72.66 90 top
R4  1.2kΩ  [R0603]  6.65 69.62 90 top
R8  10kΩ  [R0603]  29.77 9.67 270 top
R9  10kΩ  [R0603]  8.94 26.56 90 top
R10  470mΩ  [R0603]  13.13 51.45 90 top
R11  10kΩ  [R0603]  10.72 51.45 90 top
R12  10kΩ  [R0603]  13 28.47 270 top
SW10  YTSB013A0502501B  [SW-SMD_L6.0-W3.5-LS8.0]  23.8 5.71 270 bottom
SW11  TS-1096S-A2B3-C1D2  [SW-SMD_L6.0-W3.3-LS8.0]  13.89 6.12 270 bottom
U2  -  [ESOP-8_L4.9-W3.9-P1.27-LS6.0-BL-EP]  11.1 68.35 270 top
U3  AMS1117-3.3  [SOT-223-4_L6.5-W3.5-P2.30-LS7.0-BR]  26.47 63.01 180 top
U6  -  [SOP-8_L4.9-W3.9-P1.27-LS6.0-BL]  5.38 56.53 180 top
U11  PM2.54-1*5  [HDR-TH_5P-P2.54-V-F]  2.52 13.99 270 bottom
U12  PM2.54-1*5  [HDR-TH_5P-P2.54-V-F]  31.8 13.99 270 bottom
U13  ESP32-WROOM-32E-H4  [WIFI-SMD_ESP32-WROOM-32E]  18.72 16.78 90 top
USB2  U254-051N-4BH24-S2S  [MICRO-USB-SMD_U254-051N-4BH24-S2]  3.48 65.17 270 top

## Footprints (pads in the part's own frame, mm; a bottom-side part is the same pattern mirrored in y, then rotated)
BUZ-SMD_L5.0-W5.5-P4.60
  rect 1.7x0.7 smd: 1(-2.3,-1.75) 2(2.3,-1.75) 3(-2.3,1.75)
C0603
  rect 0.8x0.9 smd: 1(-0.7,0) 2(0.7,0)
CAP-SMD_L3.2-W1.6-RD
  rect 1.5x1.296 smd: 1(-1.687,0) 2(1.687,0)
CONN-TH_2P-P2.50_HCTL_HC-XHB-2AW
  rect 1.65x1.65 hole 1: 1(1.25,0)
  round 1.65 hole 1: 2(-1.25,0)
ESOP-8_L4.9-W3.9-P1.27-LS6.0-BL-EP
  rect 0.6x1.2 smd: 1(-1.905,-2.909) 2(-0.635,-2.909) 3(0.635,-2.909) 4(1.905,-2.909) 5(1.905,2.909) 6(0.635,2.909) 7(-0.635,2.909) 8(-1.905,2.909)
  rect 3.5x2.5 smd: 9(0,0)
FPC-SMD_6P-P0.50_DEALON_0.5K-DX-6PWB
  rect 0.3x1.25 smd: 1(-1.25,1.262) 2(-0.75,1.262) 3(-0.25,1.262) 4(0.25,1.262) 5(0.75,1.262) 6(1.25,1.262)
  rect 1.8x2.2 smd: 7(3.15,-1.262) 8(-3.15,-1.262)
FPC-SMD_24P-P0.50-L6.1-W16.4
  rect 0.3x1.3 smd: 1(-5.75,1.34) 2(-5.25,1.34) 3(-4.75,1.34) 4(-4.25,1.34) 5(-3.75,1.34) 6(-3.25,1.34) 7(-2.75,1.34) 8(-2.25,1.34) 9(-1.75,1.34) 10(-1.25,1.34) 11(-0.75,1.34) 12(-0.25,1.34) 13(0.25,1.34) 14(0.75,1.34) 15(1.25,1.34) 16(1.75,1.34) 17(2.25,1.34) 18(2.75,1.34) 19(3.25,1.34) 20(3.75,1.34) 21(4.25,1.34) 22(4.75,1.34) 23(5.25,1.34) 24(5.75,1.34)
  rect 2x1.6 smd: 25(7.449,-1.34) 26(-7.449,-1.34)
HDR-TH_5P-P2.54-V-F
  rect 1.575x1.575 hole 1.02: 1(-5.08,0)
  round 1.575 hole 1.02: 2(-2.54,0) 3(0,0) 4(2.54,0) 5(5.08,0)
IND-SMD_L2.0-W1.6
  rect 1x1.72 smd: 1(0.828,0) 2(-0.828,0)
LED0603-RD_RED
  rect 0.8x0.8 smd: 1(-0.799,-0.004) 2(0.799,0.004)
MICRO-USB-SMD_U254-051N-4BH24-S2
  rect 0.4x1.5 smd: 1(-1.3,1.25) 2(-0.65,1.25) 3(0,1.25) 4(0.65,1.25) 5(1.3,1.25)
  oval 1.1x2.4 hole 0.6x1.8: 6(-3.6,-1.35) 6(3.6,-1.35)
  oval 1.8x1.1 hole 1.2x0.6: 6(-2.6,1.35) 6(2.6,1.35)
  rect 1.9x1.9 smd: 6(-1.2,-1.35) 6(1.2,-1.35)
Pad_e538
  round 4 hole 2.5: 1(0,0)
Pad_e540
  round 4 hole 2.5: 1(0,0)
Pad_e602
  round 4 hole 2.5: 1(0,0)
Pad_e603
  round 4 hole 2.5: 1(0,0)
R0603
  rect 0.806x0.864 smd: 1(-0.753,0) 2(0.753,0)
SOD-123_L2.7-W1.6-LS3.7-RD-1
  rect 1.2x0.95 smd: 1(-1.7,0) 2(1.7,0)
SOD-323_L1.8-W1.3-LS2.5-RD
  rect 1x0.75 smd: 1(-1.173,0) 2(1.173,0)
SOP-8_L4.9-W3.9-P1.27-LS6.0-BL
  oval 0.63x1.865 smd: 1(-1.905,-2.683) 2(-0.635,-2.683) 3(0.635,-2.683) 4(1.905,-2.683) 5(1.905,2.683) 6(0.635,2.683) 7(-0.635,2.683) 8(-1.905,2.683)
SOT-23_L2.9-W1.3-P1.90-LS2.4-BR
  rect 1x0.8 smd: 1(1.15,-0.95) 2(1.15,0.95) 3(-1.15,0)
SOT-223-4_L6.5-W3.5-P2.30-LS7.0-BR
  rect 2.47x0.98 smd: 1(2.835,-2.3) 2(2.835,0) 3(2.835,2.3)
  rect 2.47x3.6 smd: 4(-2.835,0)
SOT-323_L2.0-W1.3-P1.30-LS2.1-BR
  rect 0.9x0.8 smd: 1(0.8,-0.65) 2(0.8,0.65) 3(-0.8,0)
SW-SMD_L6.0-W3.3-LS8.0
  rect 1.9x1.5 smd: 1(-4,0) 2(4,0)
SW-SMD_L6.0-W3.5-LS8.0
  rect 1.74x1.4 smd: 1(-3.67,0) 2(3.67,0)
WIFI-SMD_ESP32-WROOM-32E
  rect 0.95x2.1 smd: 1(-9.002,-9) 2(-7.732,-9) 3(-6.463,-9) 4(-5.192,-9) 5(-3.922,-9) 6(-2.652,-9) 7(-1.383,-9) 8(-0.113,-9) 9(1.157,-9) 10(2.428,-9) 11(3.697,-9) 12(4.968,-9) 13(6.237,-9) 14(7.508,-9) 25(7.508,9) 26(6.237,9) 27(4.968,9) 28(3.697,9) 29(2.428,9) 30(1.157,9) 31(-0.113,9) 32(-1.383,9) 33(-2.652,9) 34(-3.922,9) 35(-5.192,9) 36(-6.463,9) 37(-7.732,9) 38(-9.002,9)
  rect 2.1x0.95 smd: 15(9.002,-5.715) 16(9.002,-4.445) 17(9.002,-3.175) 18(9.002,-1.905) 19(9.002,-0.635) 20(9.002,0.635) 21(9.002,1.905) 22(9.002,3.175) 23(9.002,4.445) 24(9.002,5.715)
  rect 0.9x0.9 smd: 39(-2.721,-0.1) 39(-2.721,-1.5) 39(-2.721,-2.9) 39(-1.321,-0.1) 39(-1.321,-1.5) 39(-1.321,-2.9) 39(0.079,-0.1) 39(0.079,-1.5) 39(0.079,-2.9)

## Nets
As in the schematic.

Pads without a net: BUZZER1 1; CN2 1 6 7; FPC2 7; NOREF 1; NOREF#2 1; NOREF#3 1; NOREF#4 1; U6 4; U13 4 5 6 7 17 18 19 20 21 22 30 31 32 33 36 37; USB2 4

## Via types
v1: diameter 0.5, hole 0.305, Top Layer to Bottom Layer, 21 vias
v2: diameter 0.61, hole 0.305, Top Layer to Bottom Layer, 41 vias

## Routing (per net, layer and track width the routed paths; a pad name or vN(x,y) marks a point on that pad's centre or on a via; arc(x,y) is an arc through that point)
3V3: length 228.6
  Top Layer w0.381: U3.4 29.3,61 C36.2 ; U3.4 29.43,63.14 ; U3.4 U3.2 ; 7.26,55.39 7.29,55.36 7.29,54.94 ; 7.26,55.39 6.86,55.39 ; 7.26,55.39 7.74,55.39 ; v1(9.95,47.75) 9.07,48.64 9.07,55.01 ; U11.5 2.52,7.89 5.69,4.72 28.75,4.72 31.8,7.77 U12.5 ; 6.86,55.39 4.1,55.39 3.48,54.77 3.48,53.34 ; 6.86,55.39 6.86,55.37 7.29,54.94 ; v1(7.92,32.41) 7.92,33.61 C2.1 13.02,37.17 BUZZER1.2 13.67,37.08 ; D9.2 28.59,67.84 29.99,66.44 29.99,63.7 29.43,63.14 ; C26.1 19.06,50.58 19.06,48.13 v1(19.44,47.75) 19.44,46.36 CN2.15 CN2.16 ; U13.2 30.01,9.05 30.15,8.92 33.33,8.92 v1(33.45,9.04) ; 13.67,37.08 13.67,36.31 14.53,35.45 18.09,35.45 21.03,32.51 D8.1 ; 13.67,37.08 15.64,37.08 v1(15.67,37.1) ; 3.48,53.34 3.48,52.34 4.71,51.11 FPC2.4 ; 3.48,53.34 3.4,53.42 C3.1 ; 7.29,54.94 7.74,55.39 ; 7.29,54.94 7.29,53.34 ; 7.74,55.39 8.7,55.39 ; 9.45,55.39 9.07,55.01 ; 9.45,55.39 8.7,55.39 ; 9.45,55.39 9.6,55.39 11.86,57.65 11.86,61.36 12.37,61.87 14.4,61.87 14.97,61.3 L2.1 14.97,58.69 C21.2 ; 9.07,55.01 8.7,55.37 8.7,55.39 ; 29.43,63.14 v1(33.45,63.14) ; v1(7.92,27.33) 8.93,27.33 R9.2
  Bottom Layer w0.381: 33.45,47.69 33.45,48.25 ; 33.45,47.69 33.39,47.75 32.95,47.75 ; 33.45,47.69 33.45,47.25 ; 33.45,48.25 32.95,47.75 ; 33.45,48.25 v1(33.45,63.14) ; v1(15.67,37.1) 32.89,37.1 ; 32.89,37.1 33.36,36.64 33.45,36.64 ; 32.89,37.1 33.45,37.66 ; 32.89,37.1 33.42,37.1 33.45,37.08 ; 32.95,47.75 v1(19.44,47.75) v1(9.95,47.75) ; 32.95,47.75 33.45,47.25 ; 33.45,37.08 33.45,37.66 ; 33.45,37.08 33.45,36.64 ; 33.45,37.66 33.45,47.25 ; 33.45,36.64 v1(33.45,9.04) ; v1(7.92,32.41) v1(7.92,27.33)
GND: length 11.4
  Top Layer w0.254: U13.39 U13.39 ; U13.39 U13.39 ; U13.39 U13.39 ; U13.39 20.22,16.86 ; C21.1 14.15,58.12 v2(14.15,58.31) ; CN2.8 15.92,47.64 ; CN2.17 20.42,44.98 ; FPC2.1 3.21,51.33
  vias: v2(1.32,39.64) v2(1.32,34.31) v2(1.32,27.58) v2(1.7,51.84) v2(6.53,17.42) v2(6.53,6.62) v2(6.65,33.8) v2(6.65,30.63) v2(6.65,28.47) v2(6.65,25.93) v2(6.78,74.19) v2(8.05,61.74) v2(9.95,54) v2(9.99,6.59) v2(10.08,74.19) v2(12.37,54) v2(12.5,16.4) v2(12.62,58.57) v2(13.76,63.77) v2(14.65,14.37) v2(15.29,20.85) v2(16.69,11.96) v2(17.45,49.04) v2(17.96,18.44) v2(18.59,10.05) v2(20.5,52.98) v2(21.89,44.34) v2(22.15,70.76) v2(22.27,52.98) v2(24.43,16.02) v2(24.56,22.63) v2(24.82,70.82) v2(25.58,32.53) v2(25.58,28.98) v2(27.23,70.89) v2(28.75,31.39) v2(28.75,28.59) v2(28.75,25.8) v2(29.51,45.49) v2(29.51,39.9)
VIN: length 39.4
  Top Layer w0.381: 20.69,62.41 C37.1 20.69,62.86 ; 20.69,62.41 20.69,62.86 ; 20.69,62.41 C34.2 23.52,60.6 U3.3 ; 26.06,74.82 23.33,72.09 C6.2 19.99,70.89 16.16,67.05 ; 20.69,62.86 20.25,63.29 ; 20.69,62.86 20.69,63.73 ; 20.05,63.49 17.1,66.44 16.41,66.44 ; 20.05,63.49 20.25,63.29 ; 20.05,63.49 20.45,63.49 ; D9.1 22.27,67.84 20.69,66.25 20.69,63.73 ; 16.16,67.05 16.16,66.69 ; 16.16,67.05 15.54,66.44 ; 16.16,66.69 16.16,66.45 16.15,66.44 ; 16.16,66.69 16.41,66.44 ; 20.69,63.73 20.45,63.49 ; 16.41,66.44 16.15,66.44 ; 16.15,66.44 15.54,66.44 ; 20.25,63.29 20.45,63.49 ; 15.54,66.44 U2.5
BEEP: length 1.9
  Top Layer w0.254: R2.1 14.36,25.87 U13.23
BUSY: length 23.4
  Top Layer w0.254: CN2.9 16.42,44.07 23.16,37.33 U13.16
CH_RXD: length 51.1
  Top Layer w0.254: U6.7 6.02,52.47 v1(5.38,51.84)
  Top Layer w0.381: U11.4 9.58,11.45 U13.35
  Bottom Layer w0.254: U11.4 5.38,14.31 v1(5.38,51.84)
CH_TXD: length 48.5
  Top Layer w0.254: v1(4.75,52.34) U6.6
  Top Layer w0.381: U13.34 8.38,12.86 7.25,13.99 U11.3
  Bottom Layer w0.254: U11.3 4.37,15.84 4.37,48.53 4.75,48.92 v1(4.75,52.34)
CS: length 31.6
  Top Layer w0.254: CN2.12 17.92,45.34 30.15,33.12 30.15,22.63 29.27,21.75 U13.12
D+: length 7.6
  Top Layer w0.254: USB2.3 5.66,65.17 7.29,63.54 U6.1
D-: length 15.1
  Top Layer w0.254: U6.2 6.02,57.84 6.81,57.04 8.05,57.04 8.69,57.68 8.69,63.05 5.91,65.82 USB2.2
D/C: length 29.8
  Top Layer w0.254: CN2.11 17.42,44.85 29.51,32.76 29.51,23.52 29.02,23.02 U13.13
GDR: length 11.6
  Top Layer w0.254: CN2.2 12.92,48.74 11.73,49.93 11.73,51.19 R11.2 10.72,55 11.58,55.86 12.35,55.86
IO0: length 20.3
  Top Layer w0.381: v1(7.92,24.53) 9.48,24.53 ; 9.48,24.53 U13.25 ; 9.48,24.53 8.94,25.07 R9.1
  Bottom Layer w0.381: SW11.1 13.89,11.7 7.92,17.67 v1(7.92,24.53)
LED_GREEN: length 6.5
  Top Layer w0.254: U2.6 15.03,67.71 18.21,70.89 18.21,71.86 LED4.2
LED_RED: length 4.2
  Top Layer w0.254: LED3.2 16.43,71.86 16.43,70.89 14.53,68.98 U2.7
PREVGH: length 16.4
  Top Layer w0.254: CN2.21 22.42,48.43 24.18,50.19 24.18,52.98 23.54,53.61 19.15,53.61 18.89,53.87 D6.1 18.89,55.91 C23.2
PREVGL: length 17.8
  Top Layer w0.254: CN2.23 23.42,47.17 26.47,50.21 26.47,52.98 27.1,53.61 D4.2 21.89,54.83 20.62,56.1 C31.1
RES: length 26.6
  Top Layer w0.254: U13.14 27.76,24.33 27.76,33.56 16.92,44.4 CN2.10
RESE: length 13.7
  Top Layer w0.254: 13.65,54.67 13.78,54.79 13.96,54.79 ; 13.65,54.67 13.65,55.1 ; 13.65,54.67 13.65,52.73 R10.2 ; CN2.3 13.42,48.7 14.4,49.68 14.4,54.35 13.96,54.79 ; 13.65,55.1 13.96,54.79 ; 13.65,55.1 13.65,55.86
RST: length 6.4
  Top Layer w0.381: R8.1 29.66,10.32 U13.3 27.45,10.05 v1(24.94,10.05)
  Bottom Layer w0.381: 23.8,9.38 24.26,9.38 v1(24.94,10.05)
SCL: length 44.6
  Top Layer w0.254: FPC2.5 5.21,49.12 4.88,48.79 4.88,36.98 7.29,34.56 v1(7.41,34.56) ; U13.8 25.31,16.67 v1(23.04,18.94)
  Bottom Layer w0.254: v1(7.41,34.56) v1(23.04,18.94)
SCLK: length 53.5
  Top Layer w0.254: U13.10 29,19.21 31.54,21.76 v1(31.54,51.71) ; v1(18.21,51.58) 18.21,47.39 18.42,47.18 CN2.13
  Bottom Layer w0.254: v1(18.21,51.58) 31.42,51.58 v1(31.54,51.71)
SDA: length 42.7
  Top Layer w0.254: U13.9 25.69,17.94 v1(23.04,20.59) ; v1(8.18,35.33) 8.18,35.45 5.71,37.92 FPC2.6
  Bottom Layer w0.254: v1(8.18,35.33) 8.38,35.33 23.04,20.67 v1(23.04,20.59)
SDI: length 33
  Top Layer w0.254: U13.11 29.15,20.48 30.91,22.25 30.91,33.42 18.92,45.41 CN2.14
T_INT: length 31
  Top Layer w0.254: FPC2.2 3.71,49.27 3.33,48.89 3.33,27.73 8.04,23.02 U13.26
T_RST: length 36.3
  Top Layer w0.254: FPC2.3 4.21,48.92 3.86,48.57 3.86,35.17 11.99,27.04 11.99,20.1 11.1,19.21 U13.29
U2RXD: length 25.3
  Top Layer w0.381: U13.27 11.34,21.75 v1(11.35,21.74)
  Bottom Layer w0.381: U12.3 19.1,13.99 v1(11.35,21.74)
U2TXD: length 25.8
  Top Layer w0.381: U13.28 11.21,20.48 v1(11.22,20.47)
  Bottom Layer w0.381: U12.4 20.24,11.45 v1(11.22,20.47)
VCOM: length 5.8
  Top Layer w0.254: CN2.24 27.55,49.98 C32.1
VUSB: length 20.2
  Top Layer w0.381: v1(10.34,64.41) 10.22,64.41 U2.4 8.16,66.47 USB2.1 ; v1(10.34,71.91) R3.1 14.65,70.9 U2.8
  Bottom Layer w0.381: v1(10.34,71.91) v1(10.34,64.41)
$2N3027: length 19.8
  Top Layer w0.254: C22.1 22.23,59.46 17.32,59.46 16.56,58.69 16.56,55.57 D6.2 15.29,54.5 14.4,55.39 14.4,56.69 13.63,57.46 Q4.3 13.32,57.78 L2.2
$2N3288: length 7.6
  Top Layer w0.254: C22.2 25.73,56.87 D4.1 D5.2
$2N4058: length 5
  Top Layer w0.254: CN2.4 13.92,48.31 15.29,49.68 15.29,50.63 C24.1
$2N4145: length 5.5
  Top Layer w0.254: CN2.5 14.42,47.88 16.94,50.4 C25.1
$2N5416: length 4.4
  Top Layer w0.254: CN2.18 20.92,49.59 20.54,49.97 20.54,50.61
$2N5433: length 4.4
  Top Layer w0.254: 21.77,50.61 21.77,49.97 21.42,49.63 CN2.19
$2N5698: length 5
  Top Layer w0.254: CN2.20 21.92,48.88 23.29,50.25 23.29,50.75
$2N6495: length 5.2
  Top Layer w0.254: C30.1 25.24,50.11 22.92,47.79 CN2.22
$2N38885: length 1.6
  Top Layer w0.254: U2.2 8.07,68.86 R4.1
$2N78308: length 1.8
  Top Layer w0.254: Q7.1 15.86,29.1 R2.2
$2N78453: length 3.8
  Top Layer w0.254: BUZZER1.3 17.72,32.87 D8.2 18.44,31.65 Q7.3
$2N122372: length 1.9
  Top Layer w0.254: U13.24 R12.2
$2N122866: length 3.6
  Top Layer w0.254: R3.2 16.38,73.42 LED3.1 LED4.1

## Copper pours and planes (outline as drawn; the poured copper is in the pictures)
GND on Top Layer: -1.47,76.98 35.23,76.98 35.23,-1.88 -1.47,-1.88
GND on Bottom Layer: -4.02,78.89 36.37,78.89 36.37,-3.41 -4.02,-3.41

## Text on the board
Bottom Silkscreen Layer: TXD | RXD | 3V3 | GND | U2RX | U2TX

# Board 拓展板PCB
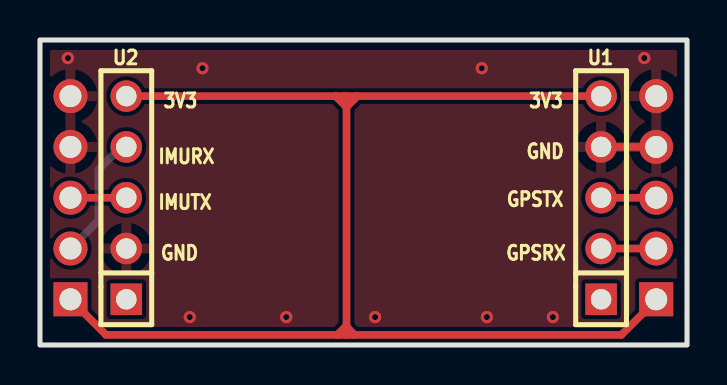
[diagram p4: board, top side]
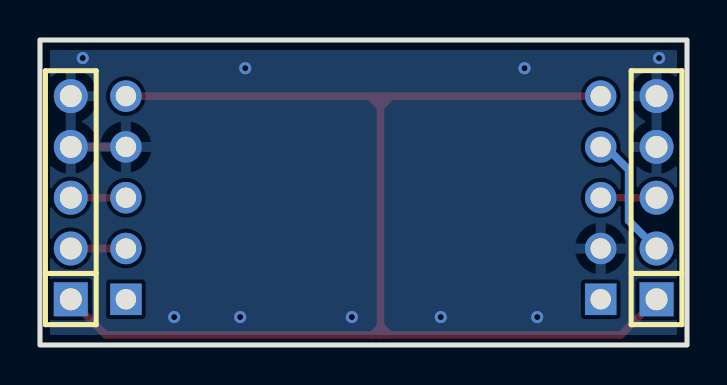
[diagram p5: board, bottom side, seen from below]

Outline 32.37 x 15.25 mm; copper layers: Top Layer, Bottom Layer. Coordinates in mm from the lower left corner of the outline.
Outline path: rectangle 0,15.25 32.37,0
Stack: Top Layer 0.035mm / Dielectric1 1.51mm FR4 er 4.5 / Bottom Layer 0.035mm

## Design rules (mm)
template: JLCPCB Capability(Two Layers Board)
spacing copperThickness1oz (default): track to track 0.102, other pairs 0.152 to 0.3
spacing copperThickness2oz: track to track 0.203, other pairs 0.152 to 0.3
track width copperThickness1oz (default): min 0.127, default 0.254, max 2.54
track width copperThickness2oz: min 0.203, default 0.254, max 2.54
differential pair differentialPair (default): width min 0.127, default 0.254, max 2.54; gap min 0.152, default 0.152
via viaSize (default): diameter min 0.5, default 0.61, max 10; hole min 0.3, default 0.305, max 6.3

## Placement (name value [footprint] x y rotation side)
H1  210-81-05GB01  [HDR-TH_5P-P2.54-V-M]  30.82 7.37 90 bottom
H2  210-81-05GB01  [HDR-TH_5P-P2.54-V-M]  1.52 7.37 90 bottom
U1  PM2.54-1*5  [HDR-TH_5P-P2.54-V-F]  28.07 7.37 90 top
U2  PM2.54-1*5  [HDR-TH_5P-P2.54-V-F]  4.32 7.37 90 top

## Footprints (pads in the part's own frame, mm; a bottom-side part is the same pattern mirrored in y, then rotated)
HDR-TH_5P-P2.54-V-F
  rect 1.575x1.575 hole 1.02: 1(-5.08,0)
  round 1.575 hole 1.02: 2(-2.54,0) 3(0,0) 4(2.54,0) 5(5.08,0)
HDR-TH_5P-P2.54-V-M
  rect 1.7x1.7 hole 1.1: 1(-5.08,0)
  round 1.7 hole 1.1: 2(-2.54,0) 3(0,0) 4(2.54,0) 5(5.08,0)

## Nets
As in the schematic.

Pads without a net: U1 1; U2 1

## Via types
v1: diameter 0.61, hole 0.305, Top Layer to Bottom Layer, 9 vias

## Routing (per net, layer and track width the routed paths; a pad name or vN(x,y) marks a point on that pad's centre or on a via; arc(x,y) is an arc through that point)
3V3: length 69.3
  Top Layer w0.381: 15.33,0.51 15.33,0.91 ; 15.33,0.51 15.74,0.51 ; 15.33,0.51 14.88,0.51 ; 15.33,0.91 15.74,0.51 ; 15.33,0.91 15.33,0.96 ; 15.33,0.96 14.88,0.51 ; 15.33,0.96 15.33,11.9 ; 14.88,0.51 3.3,0.51 H2.1 ; 15.26,12.45 15.33,12.38 15.33,11.9 ; 15.26,12.45 14.79,12.45 ; 15.26,12.45 15.88,12.45 ; H1.1 30.82,2.25 29.08,0.51 15.74,0.51 ; 14.79,12.45 15.33,11.9 ; 14.79,12.45 U2.5 ; 15.33,11.9 15.88,12.45 ; 15.88,12.45 U1.5
GND: length 2.8
  Top Layer w0.381: U1.4 H1.4
  vias: v1(1.4,14.35) v1(7.49,1.4) v1(8.13,13.84) v1(12.32,1.4) v1(16.76,1.4) v1(22.1,13.84) v1(22.35,1.4) v1(25.65,1.4) v1(30.23,14.35)
GPSRXD: length 2.8
  Top Layer w0.381: U1.2 H1.2
GPSTXD: length 2.8
  Top Layer w0.381: U1.3 H1.3
IMURXD: length 6.4
  Bottom Layer w0.381: U2.4 4.06,9.91 2.92,8.76 2.92,6.22 H2.2
IMUTXD: length 2.8
  Top Layer w0.381: H2.3 U2.3

## Copper pours and planes (outline as drawn; the poured copper is in the pictures)
GND on Top Layer: -0.63,15.75 33.15,15.75 33.15,-0.89 -0.63,-0.89
GND on Bottom Layer: -1.52,16.89 34.42,16.89 34.42,-2.16 -1.52,-2.16

## Text on the board
Top Silkscreen Layer: IMURX | IMUTX | GND | 3V3 | GPSTX | GPSRX
